# Altium schematic sheet Mid-level.SchDoc
size A
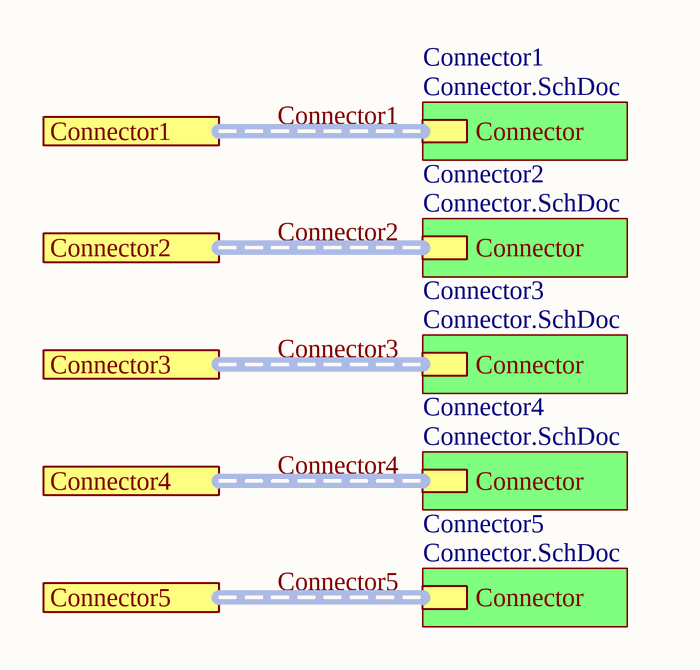
[diagram p0: Mid-level.SchDoc]

## Sub-sheets
Connector1 = Connector.SchDoc: Connector (harness Connector)
Connector2 = Connector.SchDoc: Connector (harness Connector)
Connector3 = Connector.SchDoc: Connector (harness Connector)
Connector4 = Connector.SchDoc: Connector (harness Connector)
Connector5 = Connector.SchDoc: Connector (harness Connector)

## Ports
Connector1 (harness Connector), Connector2 (harness Connector), Connector3 (harness Connector), Connector4 (harness Connector), Connector5 (harness Connector)

## Buses and harness runs
harness Connector1 = port Connector1 = sheet Connector1/Connector
harness Connector2 = port Connector2 = sheet Connector2/Connector
harness Connector3 = port Connector3 = sheet Connector3/Connector
harness Connector4 = port Connector4 = sheet Connector4/Connector
harness Connector5 = port Connector5 = sheet Connector5/Connector